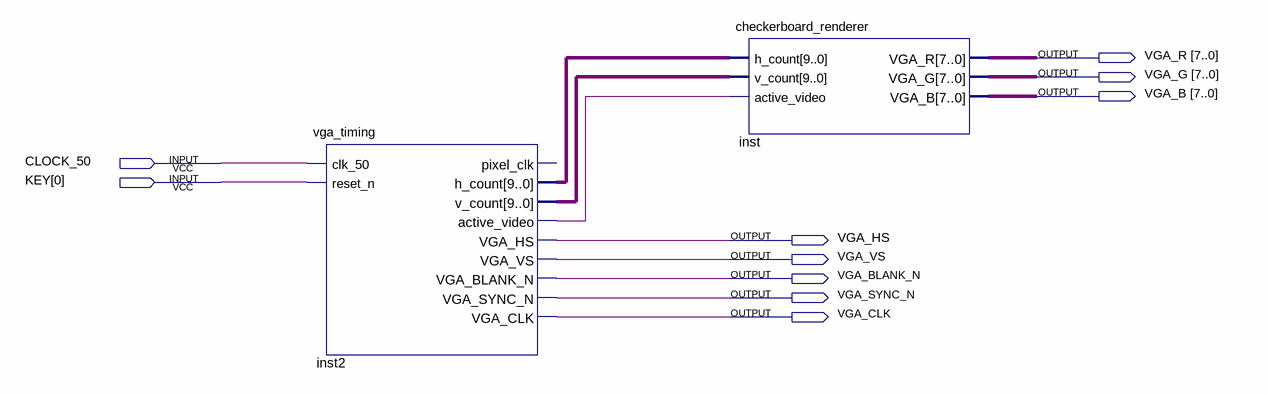
[diagram p0: schematic sheet]
// Quartus schematic niosv_top.bdf as structural Verilog: 2 symbols, 10 pins
module niosv_top (
  input  CLOCK_50,
  input  [0:0] KEY,
  output [7:0] VGA_R,
  output [7:0] VGA_G,
  output [7:0] VGA_B,
  output VGA_HS,
  output VGA_VS,
  output VGA_BLANK_N,
  output VGA_SYNC_N,
  output VGA_CLK
);

  wire inst2_active_video;
  wire [9:0] inst2_h_count, inst2_v_count;

  vga_timing inst2 (
    .clk_50(CLOCK_50), .reset_n(KEY[0]), .h_count(inst2_h_count), .v_count(inst2_v_count),
    .active_video(inst2_active_video), .VGA_HS(VGA_HS), .VGA_VS(VGA_VS), .VGA_BLANK_N(VGA_BLANK_N),
    .VGA_SYNC_N(VGA_SYNC_N), .VGA_CLK(VGA_CLK));  // open: pixel_clk
  checkerboard_renderer inst (
    .h_count(inst2_h_count), .v_count(inst2_v_count), .active_video(inst2_active_video), .VGA_R(VGA_R),
    .VGA_G(VGA_G), .VGA_B(VGA_B));
endmodule
